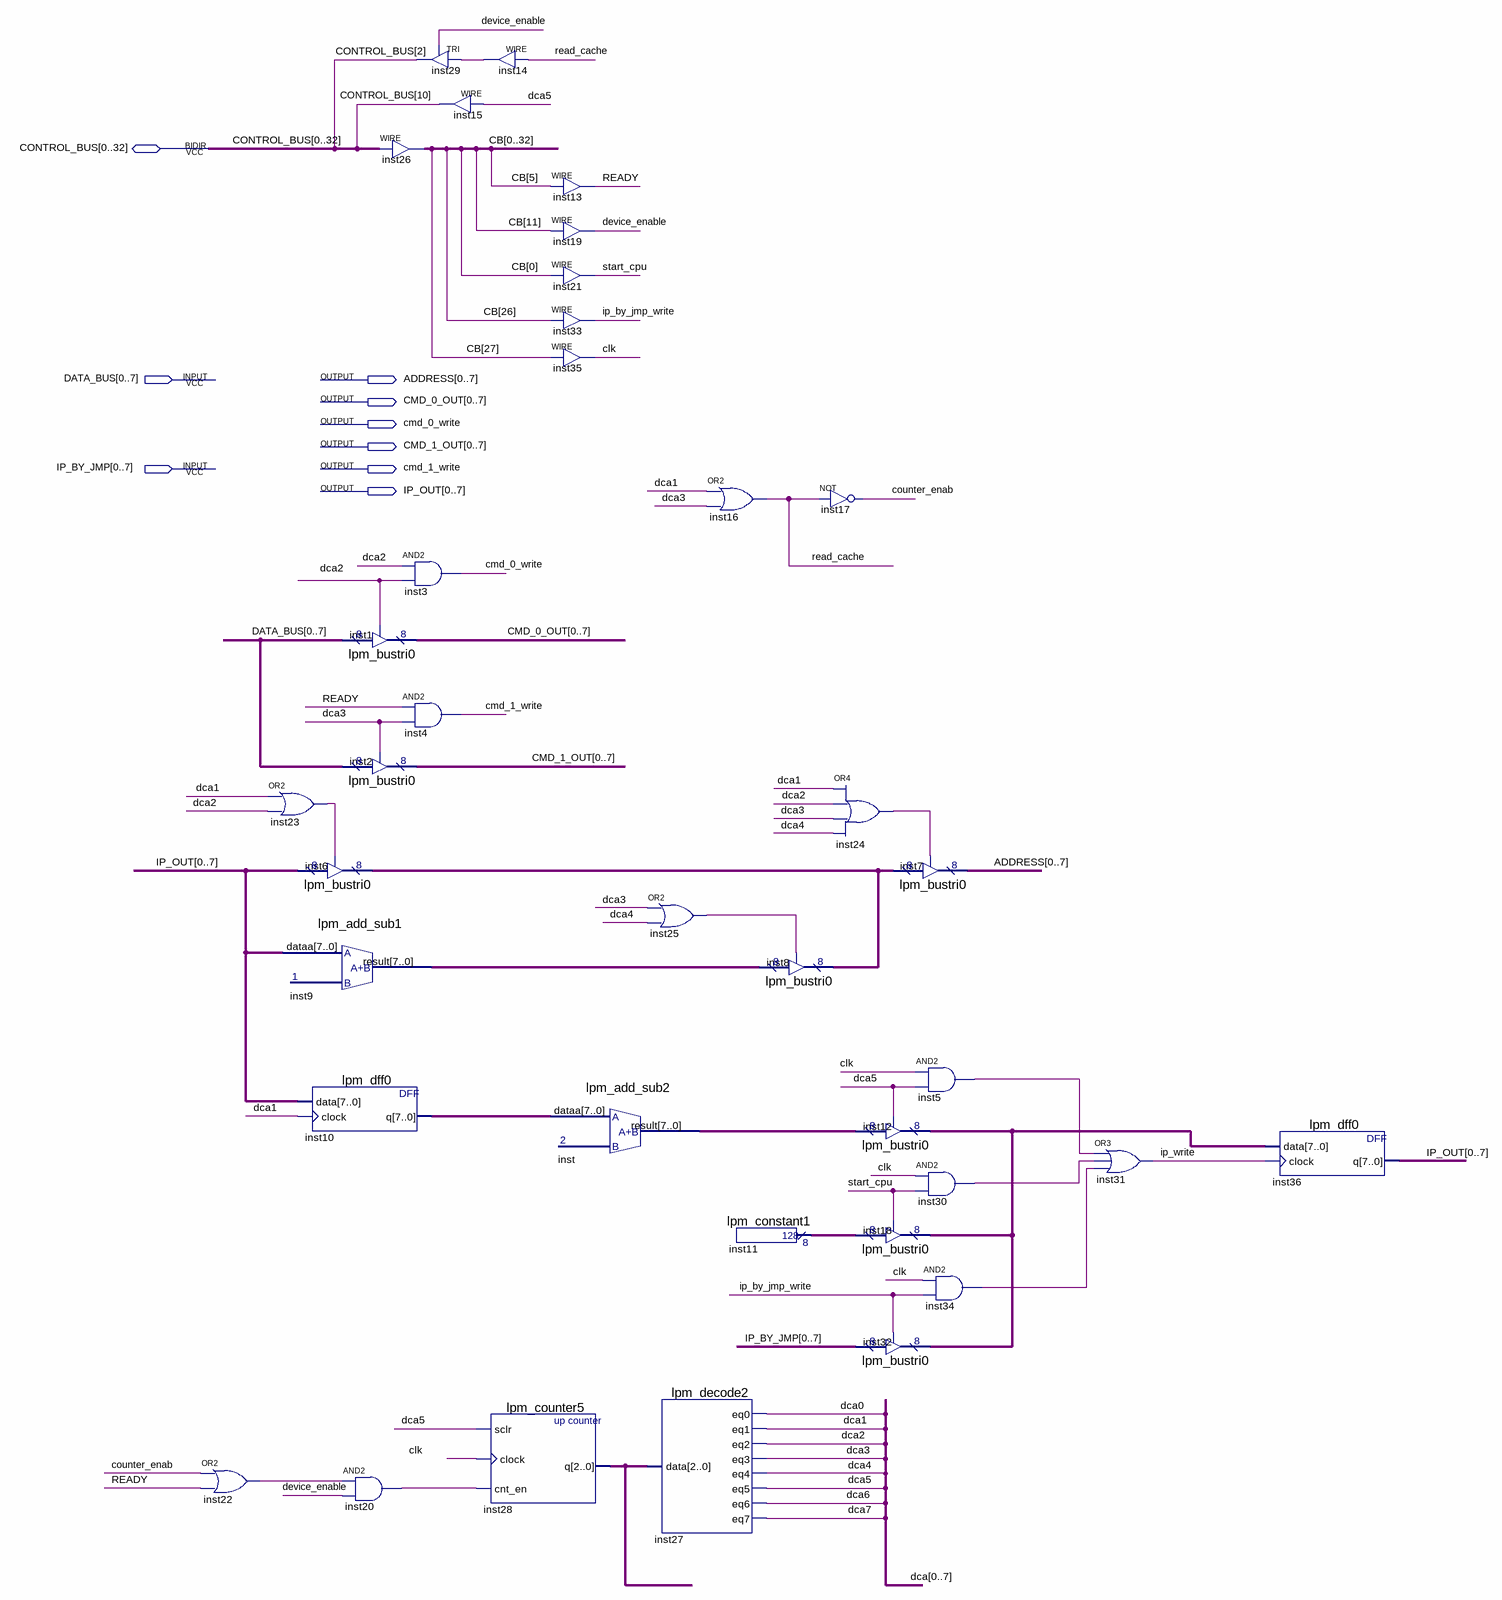
[diagram p0: schematic sheet]
// Quartus schematic IF.bdf as structural Verilog: 37 symbols, 9 pins
module IF (
  input  [0:7] DATA_BUS,
  input  [0:7] IP_BY_JMP,
  inout  [0:32] CONTROL_BUS,
  output [0:7] ADDRESS,
  output [0:7] CMD_0_OUT,
  output cmd_0_write,
  output [0:7] CMD_1_OUT,
  output cmd_1_write,
  output [0:7] IP_OUT
);

  wire clk, counter_enab, device_enable, inst5_out, inst14_out, inst20_out, inst22_out, inst23_out,
       inst24_out, inst25_out, inst30_out, inst34_out, ip_by_jmp_write, ip_write, read_cache, READY,
       start_cpu;
  wire [2:0] inst28_q;
  wire [7:0] dca, inst6_tridata, inst9_result, inst10_q, inst11_result, inst12_tridata, inst_result;
  wire [32:0] CB;

  or inst22 (inst22_out, counter_enab, READY);
  or inst23 (inst23_out, dca[1], dca[2]);
  lpm_bustri0 inst6 (.enabledt(inst23_out), .data(IP_OUT), .tridata(inst6_tridata));
  lpm_add_sub1 inst9 (.dataa(IP_OUT), .result(inst9_result));
  lpm_dff0 inst10 (.data(IP_OUT), .clock(dca[1]), .q(inst10_q));
  lpm_bustri0 inst1 (.enabledt(dca[2]), .data(DATA_BUS), .tridata(CMD_0_OUT));
  lpm_bustri0 inst2 (.enabledt(dca[3]), .data(DATA_BUS), .tridata(CMD_1_OUT));
  and inst20 (inst20_out, inst22_out, device_enable);
  TRI inst29 (.IN(inst14_out), .OE(device_enable), .OUT(CONTROL_BUS[2]));
  assign {CB[0], CB[1], CB[2], CB[3], CB[4], CB[5], CB[6], CB[7], CB[8], CB[9], CB[10], CB[11], CB[12], CB[13], CB[14], CB[15], CB[16], CB[17], CB[18], CB[19], CB[20], CB[21], CB[22], CB[23], CB[24], CB[25], CB[26], CB[27], CB[28], CB[29], CB[30], CB[31], CB[32]} = CONTROL_BUS;  // WIRE inst26
  and inst3 (cmd_0_write, dca[2], dca[2]);
  and inst4 (cmd_1_write, READY, dca[3]);
  assign inst14_out = read_cache;  // WIRE inst14
  assign CONTROL_BUS[10] = dca[5];  // WIRE inst15
  lpm_counter5 inst28 (.sclr(dca[5]), .clock(clk), .cnt_en(inst20_out), .q(inst28_q));
  assign READY = CB[5];  // WIRE inst13
  assign device_enable = CB[11];  // WIRE inst19
  assign start_cpu = CB[0];  // WIRE inst21
  assign ip_by_jmp_write = CB[26];  // WIRE inst33
  assign clk = CB[27];  // WIRE inst35
  lpm_add_sub2 inst (.dataa(inst10_q), .result(inst_result));
  or inst25 (inst25_out, dca[3], dca[4]);
  lpm_decode2 inst27 (
    .data(inst28_q), .eq0(dca[0]), .eq1(dca[1]), .eq2(dca[2]), .eq3(dca[3]), .eq4(dca[4]), .eq5(dca[5]),
    .eq6(dca[6]), .eq7(dca[7]));
  or inst16 (read_cache, dca[1], dca[3]);
  lpm_constant1 inst11 (.result(inst11_result));
  lpm_bustri0 inst8 (.enabledt(inst25_out), .data(inst9_result), .tridata(inst6_tridata));
  not inst17 (counter_enab, read_cache);
  or inst24 (inst24_out, dca[1], dca[2], dca[3], dca[4]);
  lpm_bustri0 inst7 (.enabledt(inst24_out), .data(inst6_tridata), .tridata(ADDRESS));
  lpm_bustri0 inst12 (.enabledt(dca[5]), .data(inst_result), .tridata(inst12_tridata));
  lpm_bustri0 inst18 (.enabledt(start_cpu), .data(inst11_result), .tridata(inst12_tridata));
  lpm_bustri0 inst32 (.enabledt(ip_by_jmp_write), .data(IP_BY_JMP), .tridata(inst12_tridata));
  and inst5 (inst5_out, clk, dca[5]);
  and inst30 (inst30_out, clk, start_cpu);
  and inst34 (inst34_out, clk, ip_by_jmp_write);
  or inst31 (ip_write, inst5_out, inst30_out, inst34_out);
  lpm_dff0 inst36 (.data(inst12_tridata), .clock(ip_write), .q(IP_OUT));
endmodule
